# Altium schematic sheet 单管放大电路.SchDoc
size A4
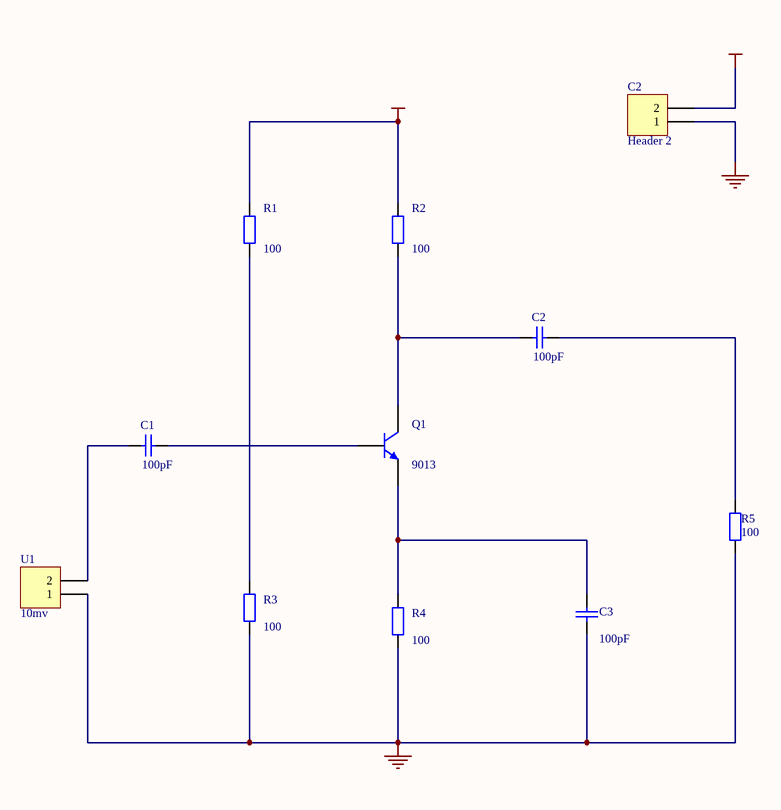
[diagram p0: 单管放大电路.SchDoc]

## Parts
(Parts that share a designator on the sheet are numbered #1, #2 ... from top to bottom, then left to right.)
C1  value 100pF  [RB7.6-15]  (hidden comment: Cap)
C2#1  Header 2  [HDR1X2]
C2#2  value 100pF  [RB7.6-15]  (hidden comment: 4)
C3  value 100pF  [RB7.6-15]  (hidden comment: Cap)
Q1  9013  [BCY-W3]
R1  value 100  [AXIAL-0.4]  (hidden comment: Res2)
R2  value 100  [AXIAL-0.4]  (hidden comment: Res2)
R3  value 100  [AXIAL-0.4]  (hidden comment: Res2)
R4  100  [AXIAL-0.4]
R5  value 100  [AXIAL-0.4]  (hidden comment: Res2)
U1  10mv  [HDR1X2]

## Nets
GND: C2#1.1 C3.1 R3.1 R4.2 R5.1 U1.1
VCC: C2#1.2 R1.2 R2.2
NetC1_1: C1.1 U1.2
NetC1_2: C1.2 Q1.2(B)
NetC2#2_1: C2#2.1 Q1.1(C) R2.1
NetC2#2_2: C2#2.2 R5.2
NetC3_2: C3.2 Q1.3(E) R4.1
NetR1_1: R1.1 R3.2

## Library data of the parts
C1 C2#2 C3 = Cap: Capacitor; Published: 8-Jun-2000; LatestRevisionDate: 17-Jul-2002; LatestRevisionNote: Re-released for DXP Platform.; Publisher: Altium Limited
C2#1 U1 = Header 2: Header, 2-Pin; LatestRevisionDate: 17-Jul-2002; LatestRevisionNote: Re-released for DXP Platform.; Publisher: Altium Limited
Q1 = NPN: NPN Bipolar Transistor; Published: 8-Jun-2000; LatestRevisionDate: 17-Jul-2002; LatestRevisionNote: Re-released for DXP Platform.; Publisher: Altium Limited; Code_JEDEC: TO-226-AA
R1-R5 = Res2: Resistor; Published: 8-Jun-2000; LatestRevisionDate: 17-Jul-2002; LatestRevisionNote: Re-released for DXP Platform.; Publisher: Altium Limited
  R4: Value: 100